# EasyEDA Pro project 多口输出板.epro

# Schematic Schematic1_3
Create Date: 2024-06-11; Page Name: P1; Project Name: 非小车电路板; Schematic Name: Schematic1_3; Update Date: 2024-06-11; Company: 嘉立创EDA; Page Size: A4; Version: V1.0
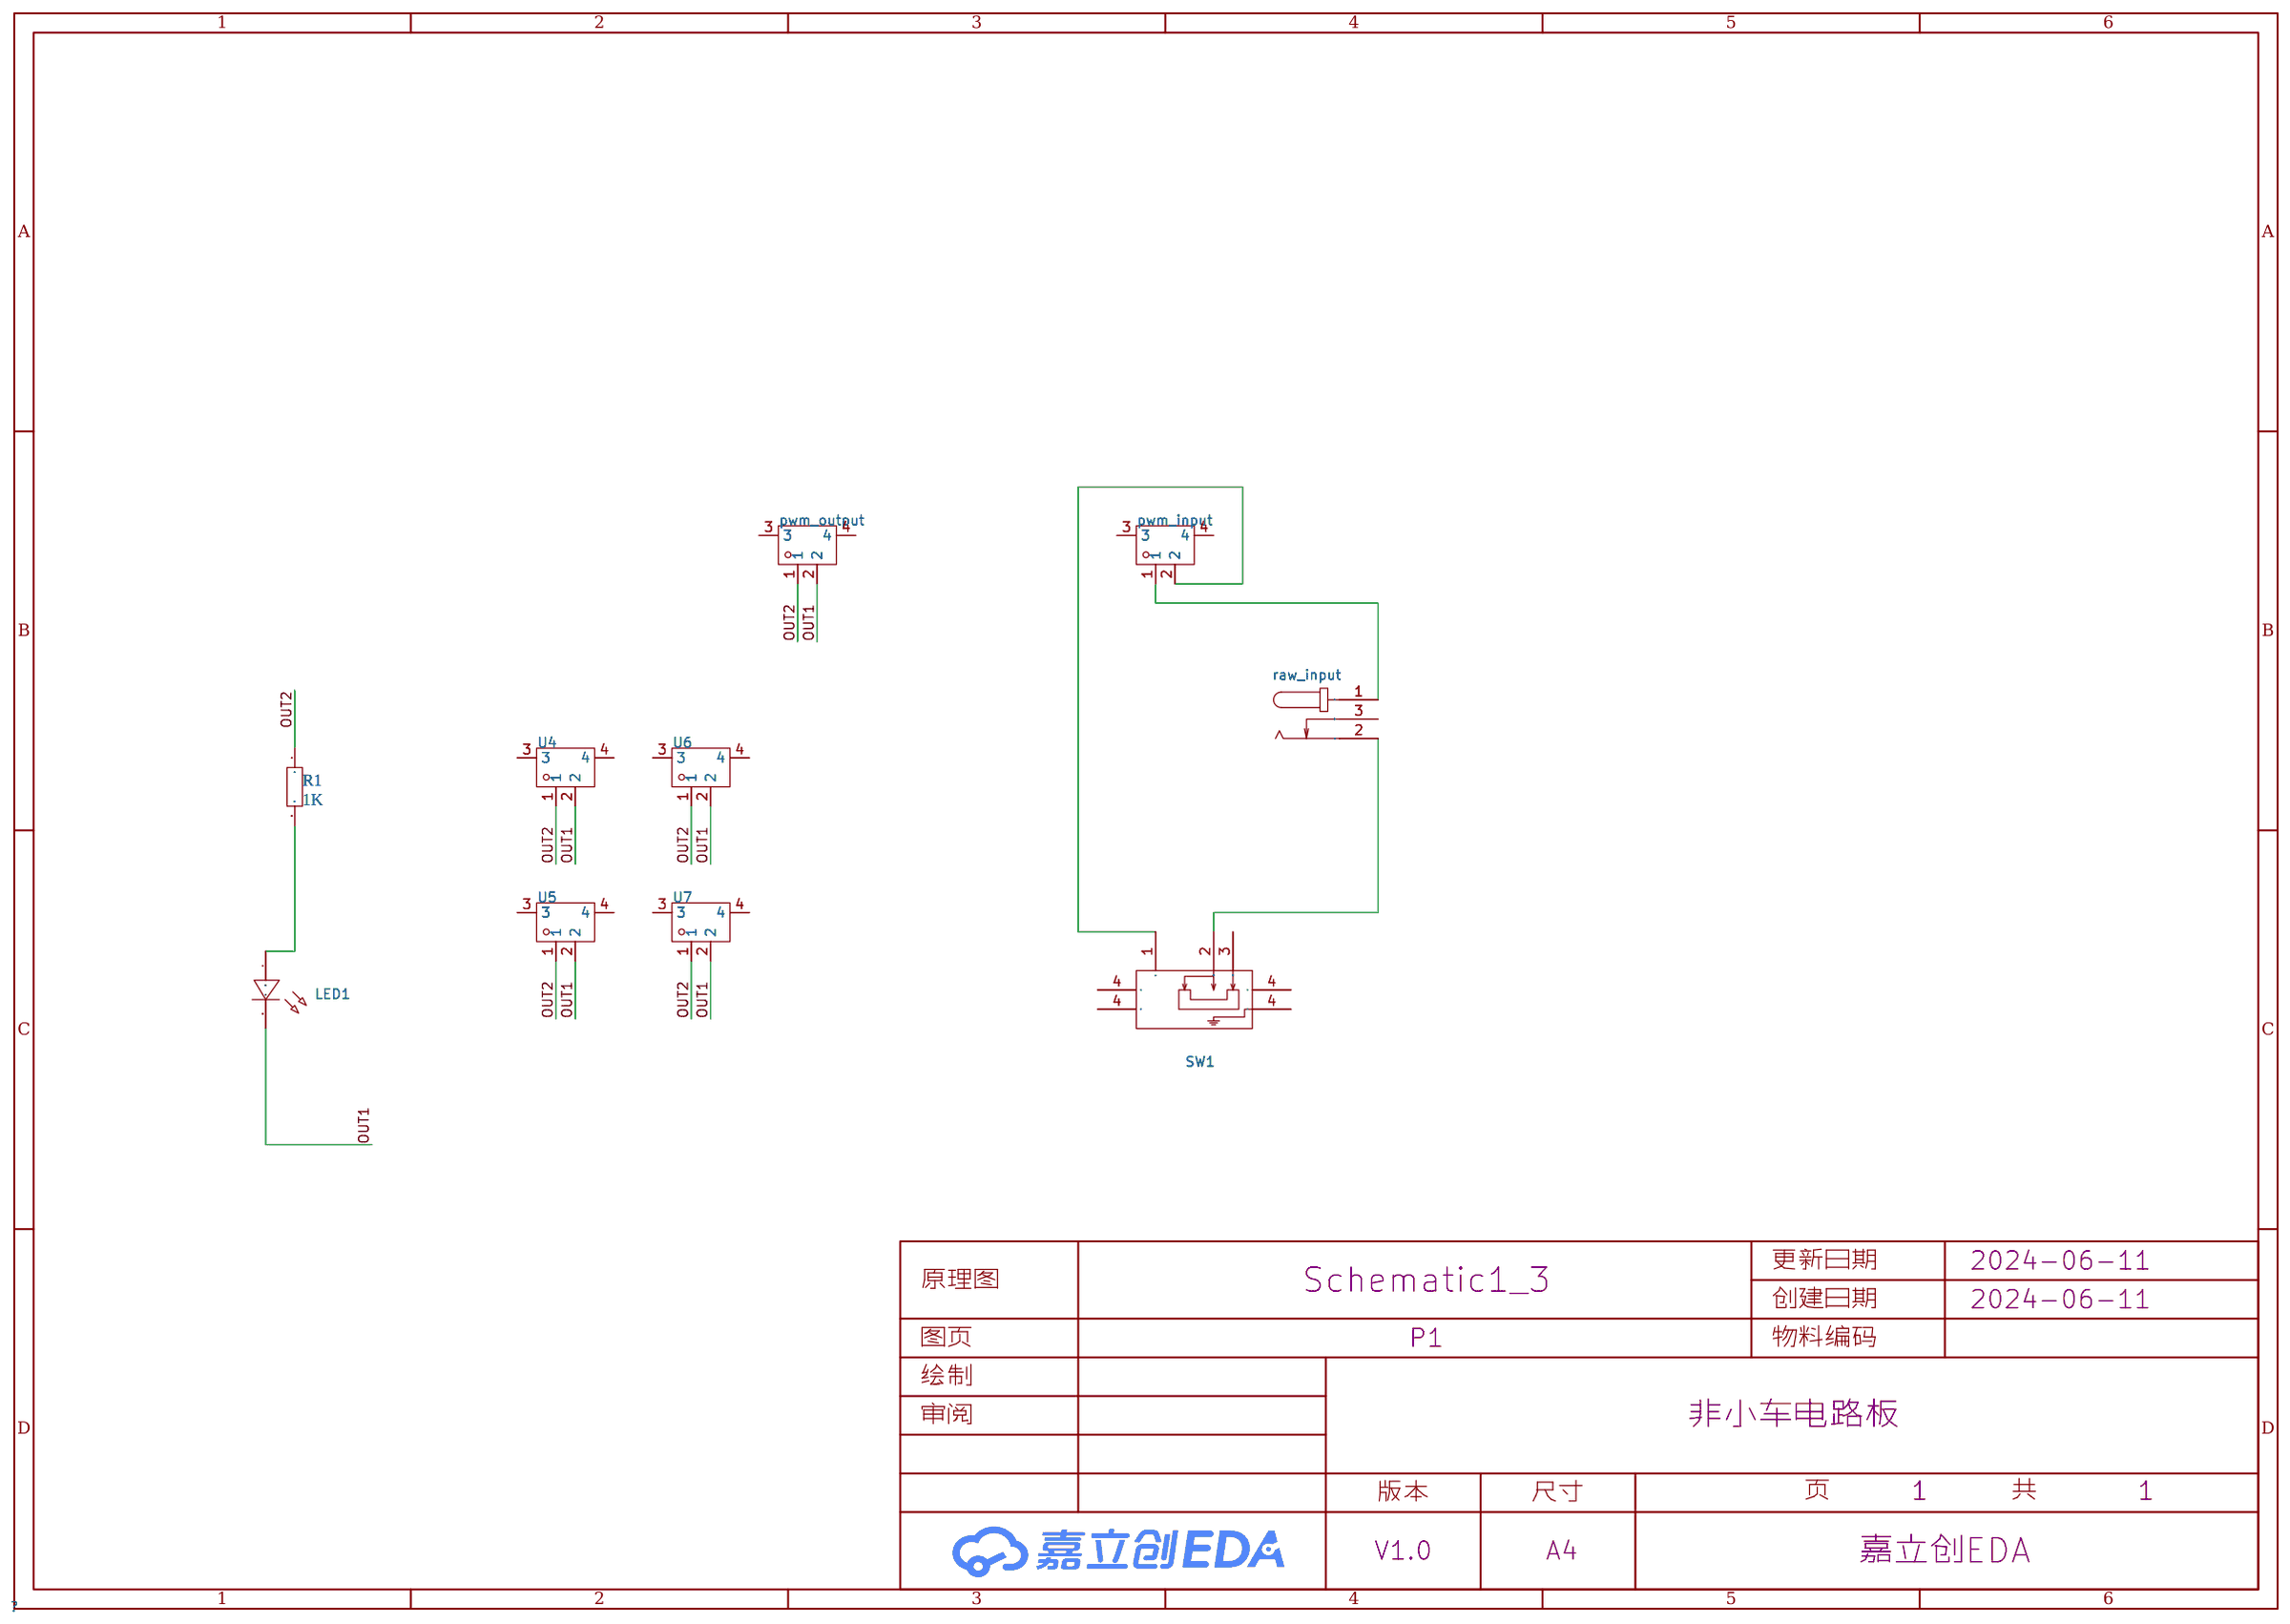
[diagram p0: schematic sheet]

## Parts
LED1  -  [LED0805-R-RD_RED]
pwm_input  XD-GH-2PWT  [CONN-SMD_GH-2PWT]
pwm_output  XD-GH-2PWT  [CONN-SMD_GH-2PWT]
R1  1K  [R0805]
raw_input  DC-005-A200  [DC-IN-TH_DC-005-A200]
SW1  MSK12C02  [SW-TH_MSK12C02]
U4  XD-GH-2PWT  [CONN-SMD_GH-2PWT]
U5  XD-GH-2PWT  [CONN-SMD_GH-2PWT]
U6  XD-GH-2PWT  [CONN-SMD_GH-2PWT]
U7  XD-GH-2PWT  [CONN-SMD_GH-2PWT]

## Library data of the parts
LED1 = LED_TH-R_3mm: Supplier Footprint: 插件
pwm_input pwm_output U4-U7 = XD-GH-2PWT: 参考系列:GH;间距:1.25mm;插针结构:1x2P;排数:1;每排PIN数:2;公母:公型插针;安装方式:卧贴;额定电流:1A;触头镀层:锡;工作温度范围:-40℃~+105℃;; LCSC Part Name: 间距:1.25mm 1x2P 卧贴 带扣 线对板/线对线连接器; Supplier Part: C17700380; Manufacturer: XUNDA(讯答); Supplier Footprint: SMD,P=1.25mm; Datasheet: https://atta.szlcsc.com/upload/public/pdf/source/20231019/0574E105206498063B39A8D5088E5395.pdf; Supplier: LCSC; Reference Series: GH; Pitch: 1.25mm; Pins Structure: 1x2P; Number of Rows: 1; Number of PINs Per Row: 2; Gender: 公型插针; Mounting Style: 卧贴; Current Rating (Max): 1A; Contact Plating: 锡; Operating Temperature Range: -40℃~+105℃
R1 = Res1: 贴片电阻; Published: 8-Jun-2000; LatestRevisionDate: 17-Jul-2002; LatestRevisionNote: Re-released for DXP Platform.; PackageReference: AXIAL-0.4; Publisher: Altium Limited; Origin Footprint 2: 0805-2; Origin Footprint 3: 0603-1; Origin Footprint 4: 1210; Origin Footprint 5: AXIAL-0.8; Origin Footprint 6: 2010; Origin Footprint 7: 0603-2; Origin Footprint 8: 1206; Origin Footprint 9: 2512; Origin Footprint 10: 1812; Origin Footprint 11: AXIAL-0.9; Origin Footprint 1: 0805-1; Library Name: fszhang
raw_input = DC-005-A200: 连接器类型:DC电源插座;安装方式:弯插;触点内径:2mm;触点外径:6.4mm;额定电流:3A;额定电压:30V;工作温度范围:-20℃~+70℃;; LCSC Part Name: DC电源插座 内径:2mm 外径:6.4mm; Supplier Part: C720557; Manufacturer: XUNPU(讯普); Supplier Footprint: 插件; JLCPCB Part Class: 扩展库; Datasheet: https://atta.szlcsc.com/upload/public/pdf/source/20200812/C720557_2286DFCD6C75B71AF905731F627ABF3A.pdf; Supplier: LCSC; Connector Type: DC电源插座; Mounting Style: 弯插; Inside Contact Diameter: 2mm; Outside Contact Diameter: 6.4mm; Current Rating (Max): 3A; Voltage Rating (Max): 30V; Operating Temperature Range: -20℃~+70℃
SW1 = MSK12C02: LCSC Part Name: 两档侧拨贴片 7脚 拨动 白柄 柄长1.5mm,带定位柱; Supplier Part: C431540; Manufacturer: SHOU HAN(首韩); Supplier Footprint: SMD; JLCPCB Part Class: Extended Part; Datasheet: https://atta.szlcsc.com/upload/public/pdf/source/20190925/C431540_89155AEF0758B9AD1B2D805F83FB12E3.pdf; Supplier: LCSC

## Nets
OUT1: LED1.2(A) pwm_output.2 U4.2 U5.2 U6.2 U7.2
OUT2: pwm_output.1 R1.1 U4.1 U5.1 U6.1 U7.1
Net-(LED1-1): LED1.1(C) R1.2
Net-(pwm_input-1): pwm_input.1 raw_input.1
Net-(pwm_input-2): pwm_input.2 SW1.1
Net-(raw_input-2): raw_input.2 SW1.2

Not connected (* = marked no-connect by the designer): pwm_input 3 4; pwm_output 3 4; raw_input 3; SW1 3 4; U4 3 4; U5 3 4; U6 3 4; U7 3 4

# Board PCB1_3
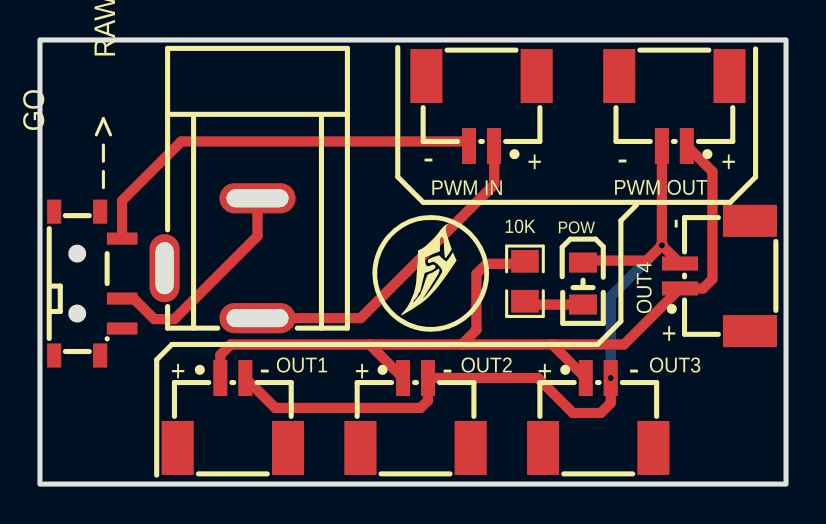
[diagram p1: board, top side]
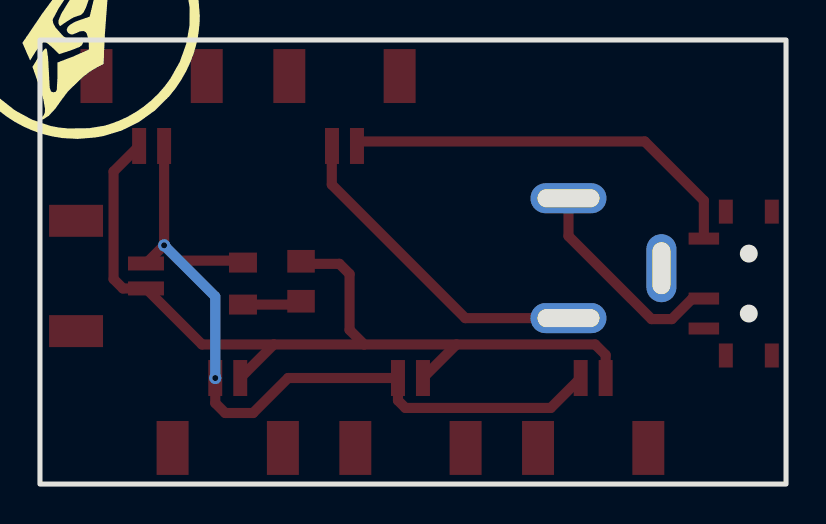
[diagram p2: board, bottom side, seen from below]

Outline 37.34 x 22.22 mm; copper layers: Top Layer, Bottom Layer. Coordinates in mm from the lower left corner of the outline.
Outline path: rectangle 0,22.22 37.34,0
Stack: Top Layer 0.035mm / Dielectric1 1.51mm FR4 er 4.5 / Bottom Layer 0.035mm

## Design rules (mm)
template: JLCPCB Capability(Two Layers Board)
spacing copperThickness1oz (default): track to track 0.102, other pairs 0.152 to 0.3
spacing copperThickness2oz: track to track 0.203, other pairs 0.152 to 0.3
track width copperThickness1oz (default): min 0.127, default 0.254, max 2.54
track width copperThickness2oz: min 0.203, default 0.254, max 2.54
differential pair differentialPair (default): width min 0.127, default 0.254, max 2.54; gap min 0.152, default 0.152
via viaSize (default): diameter min 0.5, default 0.61, max 10; hole min 0.3, default 0.305, max 6.3

## Placement (name value [footprint] x y rotation side)
10K  -  [R0805]  24.27 10.15 270 top
GO  MSK12C02  [SW-TH_MSK12C02]  2.41 10.03 270 top
OUT1  XD-GH-2PWT  [CONN-SMD_GH-2PWT]  9.65 3.56 0 top
OUT2  XD-GH-2PWT  [CONN-SMD_GH-2PWT]  18.8 3.56 0 top
OUT3  XD-GH-2PWT  [CONN-SMD_GH-2PWT]  27.94 3.56 0 top
OUT4  XD-GH-2PWT  [CONN-SMD_GH-2PWT]  33.78 10.41 90 top
POW  -  [LED0805-R-RD_RED]  27.18 10.03 270 top
PWM IN  XD-GH-2PWT  [CONN-SMD_GH-2PWT]  22.1 18.67 180 top
PWM OUT  XD-GH-2PWT  [CONN-SMD_GH-2PWT]  31.75 18.67 180 top
RAW IN  DC-005-A200  [DC-IN-TH_DC-005-A200]  8.56 11.3 270 top

## Footprints (pads in the part's own frame, mm; a bottom-side part is the same pattern mirrored in y, then rotated)
CONN-SMD_GH-2PWT
  rect 0.7x1.8 smd: 1(-0.625,1.75) 2(0.625,1.75)
  rect 1.6x2.7 smd: 3(-2.76,-1.75) 4(2.76,-1.75)
DC-IN-TH_DC-005-A200
  oval 1.5x3.8 hole 0.9x3.1: 1(2.999,2.325) 2(-3,2.325)
  oval 3.4x1.5 hole 2.6x0.9: 3(0.5,-2.325)
LED0805-R-RD_RED
  rect 1x1.399 smd: 1(1.05,0) 2(-1.05,0)
R0805
  rect 1.133x1.377 smd: 1(-1,0) 2(1,0)
SW-TH_MSK12C02
  rect 0.6x1.524 smd: 1(-2.25,1.7) 2(0.75,1.7) 3(2.25,1.7)
  rect 1.2x0.7 smd: 4(-3.6,0.6) 4(-3.6,-1.7) 4(3.6,0.6) 4(3.6,-1.7)

## Nets
OUT1: OUT1.2 OUT2.2 OUT3.2 OUT4.2 POW.2 PWM OUT.2
OUT2: 10K.1 OUT1.1 OUT2.1 OUT3.1 OUT4.1 PWM OUT.1
$1N1089: PWM IN.1 RAW IN.1
$1N1154: GO.1 PWM IN.2
$1N1161: GO.2 RAW IN.2
$1N1283: 10K.2 POW.1

Pads without a net: GO 3 4; OUT1 3 4; OUT2 3 4; OUT3 3 4; OUT4 3 4; PWM IN 3 4; PWM OUT 3 4; RAW IN 3

## Via types
v1: diameter 0.61, hole 0.305, Top Layer to Bottom Layer, 2 vias

## Routing (per net, layer and track width the routed paths; a pad name or vN(x,y) marks a point on that pad's centre or on a via; arc(x,y) is an arc through that point)
OUT1: length 40.6
  Top Layer w0.508: OUT1.2 11.77,3.81 19.05,3.81 19.42,4.18 OUT2.2 24.92,5.31 26.67,3.56 28.07,3.56 28.57,4.05 v1(28.57,5.31) ; 27.21,11.18 30.36,11.18 v1(31.13,11.95) ; PWM OUT.2 v1(31.13,11.95) ; v1(31.13,11.95) OUT4.2
  Bottom Layer w0.508: v1(28.57,5.31) 28.57,9.39 v1(31.13,11.95)
OUT2: length 45.8
  Top Layer w0.508: 24.27,11.02 22.35,11.02 21.84,10.51 21.84,7.71 21.11,6.98 ; 25.64,6.98 OUT3.1 ; 25.64,6.98 21.11,6.98 ; 25.64,6.98 29.23,6.98 OUT4.1 33.19,9.79 33.66,10.26 33.66,15.64 PWM OUT.1 ; 21.11,6.98 16.49,6.98 ; 16.49,6.98 OUT2.1 ; 16.49,6.98 9.55,6.98 9.03,6.46 OUT1.1
$1N1089: length 16.6
  Top Layer w0.508: RAW IN.1 16.05,8.3 22.73,14.99 22.73,16.91 PWM IN.1
$1N1154: length 20.6
  Top Layer w0.508: GO.1 4.11,14.19 7.07,17.14 21.25,17.14 PWM IN.2
$1N1161: length 10.8
  Top Layer w0.508: RAW IN.2 10.89,12.41 6.73,8.25 5.72,8.25 4.69,9.28 GO.2
$1N1283: length 3
  Top Layer w0.508: 27.21,8.98 24.31,8.98 24.27,9.02

## Text on the board
Top Silkscreen Layer: --> | + | -
